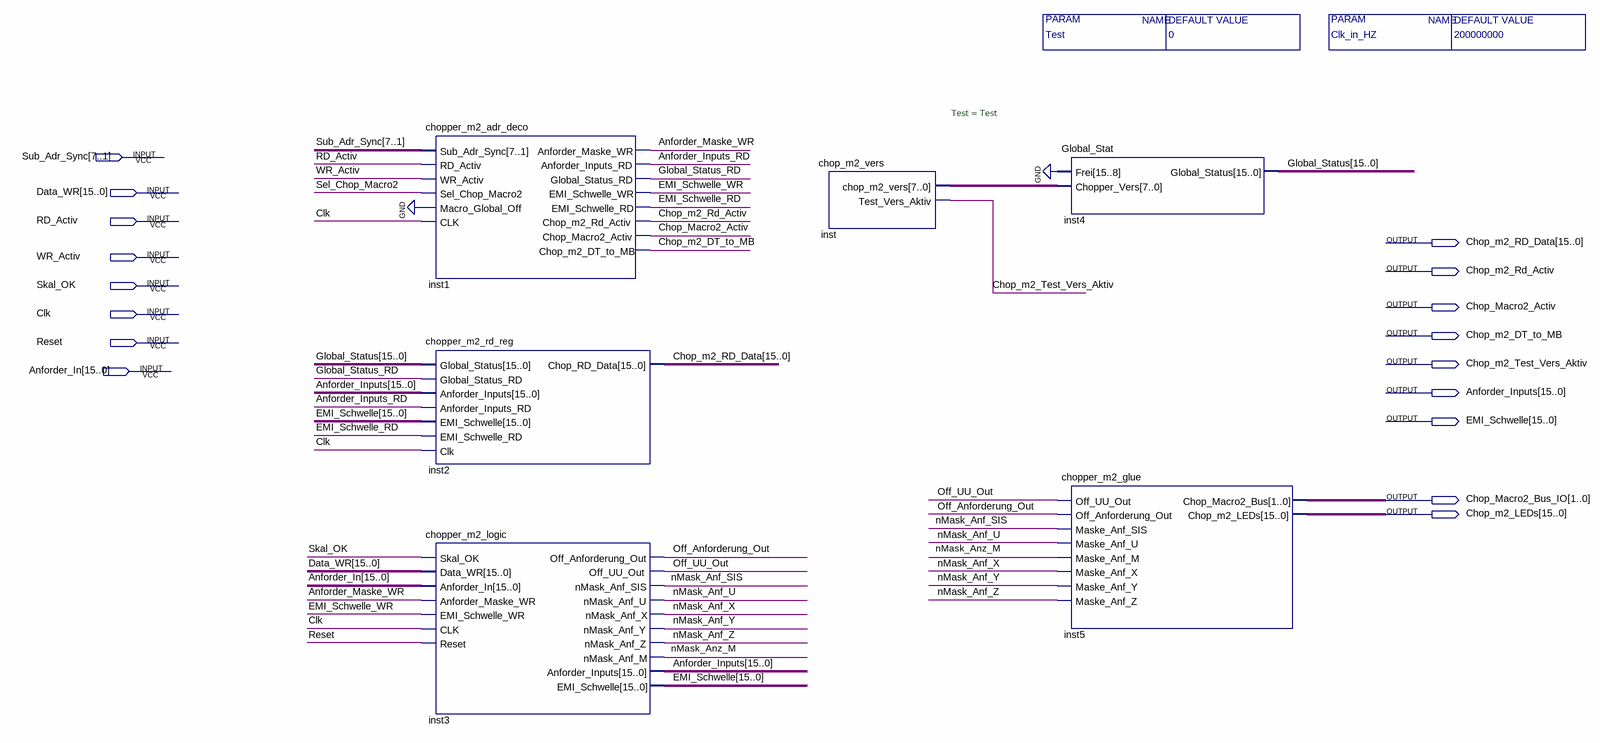
[diagram p0: schematic sheet]
// Quartus schematic chopper_macro2_vhdl.bdf as structural Verilog: 6 symbols, 17 pins
module chopper_macro2_vhdl #(parameter Test = 0, parameter Clk_in_HZ = 200000000) (
  input  [7:1] Sub_Adr_Sync,
  input  [15:0] Data_WR,
  input  RD_Activ,
  input  WR_Activ,
  input  Skal_OK,
  input  Clk,
  input  Reset,
  input  [15:0] Anforder_In,
  output [15:0] Chop_m2_RD_Data,
  output Chop_m2_Rd_Activ,
  output Chop_Macro2_Activ,
  output Chop_m2_DT_to_MB,
  output Chop_m2_Test_Vers_Aktiv,
  output [15:0] Anforder_Inputs,
  output [15:0] EMI_Schwelle,
  output [1:0] Chop_Macro2_Bus_IO,
  output [15:0] Chop_m2_LEDs
);

  wire Anforder_Inputs_RD, Anforder_Maske_WR, EMI_Schwelle_RD, EMI_Schwelle_WR, Global_Status_RD,
       nMask_Anf_SIS, nMask_Anf_U, nMask_Anf_X, nMask_Anf_Y, nMask_Anf_Z, nMask_Anz_M, Off_Anforderung_Out,
       Off_UU_Out, Sel_Chop_Macro2;
  wire [7:0] inst_chop_m2_vers;
  wire [15:0] Global_Status;

  chopper_m2_adr_deco inst1 (
    .Sub_Adr_Sync(Sub_Adr_Sync), .RD_Activ(RD_Activ), .WR_Activ(WR_Activ), .Sel_Chop_Macro2(Sel_Chop_Macro2),
    .Macro_Global_Off(1'b0), .CLK(Clk), .Anforder_Maske_WR(Anforder_Maske_WR),
    .Anforder_Inputs_RD(Anforder_Inputs_RD), .Global_Status_RD(Global_Status_RD),
    .EMI_Schwelle_WR(EMI_Schwelle_WR), .EMI_Schwelle_RD(EMI_Schwelle_RD),
    .Chop_m2_Rd_Activ(Chop_m2_Rd_Activ), .Chop_Macro2_Activ(Chop_Macro2_Activ),
    .Chop_m2_DT_to_MB(Chop_m2_DT_to_MB));
  chopper_m2_rd_reg inst2 (
    .Global_Status(Global_Status), .Global_Status_RD(Global_Status_RD), .Anforder_Inputs(Anforder_Inputs),
    .Anforder_Inputs_RD(Anforder_Inputs_RD), .EMI_Schwelle(EMI_Schwelle), .EMI_Schwelle_RD(EMI_Schwelle_RD),
    .Clk(Clk), .Chop_RD_Data(Chop_m2_RD_Data));
  chopper_m2_logic inst3 (
    .Skal_OK(Skal_OK), .Data_WR(Data_WR), .Anforder_In(Anforder_In), .Anforder_Maske_WR(Anforder_Maske_WR),
    .EMI_Schwelle_WR(EMI_Schwelle_WR), .CLK(Clk), .Reset(Reset), .Off_Anforderung_Out(Off_Anforderung_Out),
    .Off_UU_Out(Off_UU_Out), .nMask_Anf_SIS(nMask_Anf_SIS), .nMask_Anf_U(nMask_Anf_U),
    .nMask_Anf_X(nMask_Anf_X), .nMask_Anf_Y(nMask_Anf_Y), .nMask_Anf_Z(nMask_Anf_Z),
    .nMask_Anf_M(nMask_Anz_M), .Anforder_Inputs(Anforder_Inputs), .EMI_Schwelle(EMI_Schwelle));
  chop_m2_vers #(.Test(Test)) inst (.chop_m2_vers(inst_chop_m2_vers), .Test_Vers_Aktiv(Chop_m2_Test_Vers_Aktiv));
  Global_Stat inst4 (.Frei({8{1'b0}}), .Chopper_Vers(inst_chop_m2_vers), .Global_Status(Global_Status));
  chopper_m2_glue inst5 (
    .Off_UU_Out(Off_UU_Out), .Off_Anforderung_Out(Off_Anforderung_Out), .Maske_Anf_SIS(nMask_Anf_SIS),
    .Maske_Anf_U(nMask_Anf_U), .Maske_Anf_M(nMask_Anz_M), .Maske_Anf_X(nMask_Anf_X),
    .Maske_Anf_Y(nMask_Anf_Y), .Maske_Anf_Z(nMask_Anf_Z), .Chop_Macro2_Bus(Chop_Macro2_Bus_IO),
    .Chop_m2_LEDs(Chop_m2_LEDs));
endmodule
